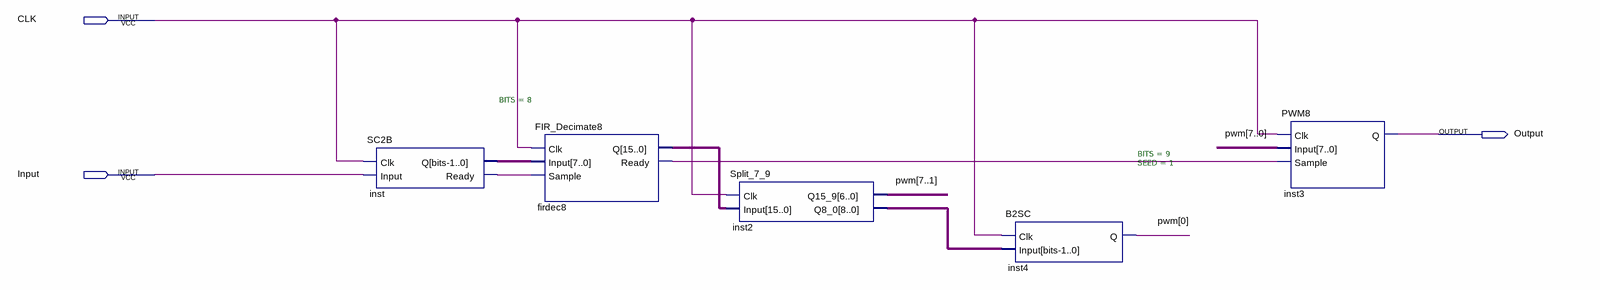
[diagram p0: schematic sheet]
// Quartus schematic OutputFilter.bdf as structural Verilog: 5 symbols, 3 pins
module OutputFilter (
  input  CLK,
  input  Input,
  output Output
);

  wire firdec8_ready, inst_ready;
  wire [7:0] inst_q, pwm;
  wire [8:0] inst2_q8_0;
  wire [15:0] firdec8_q;

  SC2B #(.BITS(8)) inst (.Clk(CLK), .Input(Input), .Q(inst_q), .Ready(inst_ready));
  FIR_Decimate8 firdec8 (.Clk(CLK), .Input(inst_q), .Sample(inst_ready), .Q(firdec8_q), .Ready(firdec8_ready));
  Split_7_9 inst2 (.Clk(CLK), .Input(firdec8_q), .Q15_9(pwm[7:1]), .Q8_0(inst2_q8_0));
  B2SC #(.BITS(9), .SEED(1)) inst4 (.Clk(CLK), .Input(inst2_q8_0), .Q(pwm[0]));
  PWM8 inst3 (.Clk(CLK), .Input(pwm), .Sample(firdec8_ready), .Q(Output));
endmodule
